# Altium schematic sheet Sheet2 (1).SchDoc
size A3; SheetNumber: 1; SheetTotal: 1
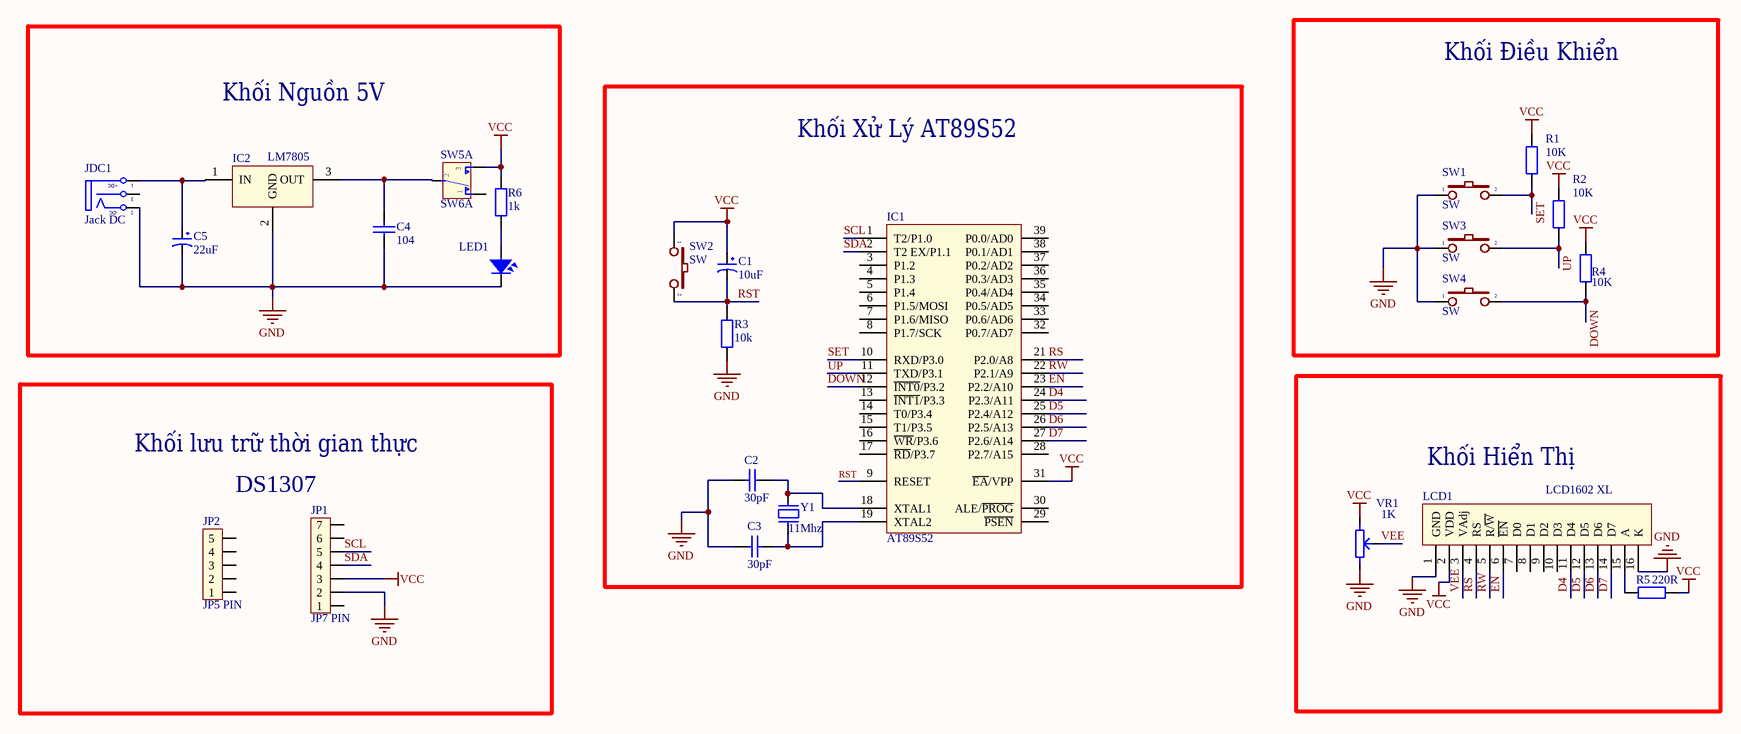
[diagram p0: Sheet2 (1).SchDoc]

## Parts
C1  10uF  [tu hoa 4mm]
C2  30pF  [tu gom]
C3  30pF  [tu gom]
C4  104  [tu gom]
C5  22uF  [tu hoa 5mm]
IC1  AT89S52  [DIP40/W0.6]
IC2  LM7805  [QTO-220]
JDC1  Jack DC  [DC-IN]
JP1  JP7 PIN  [JP7_1]
JP2  JP5 PIN  [JP5_1]
LCD1  LCD1602 XL  [LCD1602 with Jump]
LED1  LED  [LED-5-RED]  (value not drawn)
R1  10K  [tro vach 1/4w]
R2  10K  [tro vach 1/4w]
R3  10k  [tro vach 1/4w]
R4  10K  [tro vach 1/4w]
R5  220R  [tro vach 1/4w]
R6  1k  [R1/4W]
SW1  SW  [SW2]
SW2  SW  [SW2]
SW3  SW  [SW2]
SW4  SW  [SW2]
SW5  SW6A  [SW6]  (part A of 2)
VR1  1K  [Bien Tro Tam Giac Dung]
Y1  11Mhz  [Thach Anh 2 chan cam]

## Blocks framed on the sheet
Khối Điều Khiển: R1 R2 R4 SW1 SW3 SW4
Khối Nguồn 5V: C4 C5 IC2 JDC1 LED1 R6 SW5
Khối Xử Lý AT89S52: C1-C3 IC1 R3 SW2 Y1
Khối Hiển Thị: LCD1 R5 VR1

## Nets
GND: C2.2 C3.2 C4.2 C5.2 IC1.20(GND) IC2.2(GND) JDC1.2(TN) JP1.2 LCD1.1(GND) LCD1.16(K) LED1.2 R3.1 SW1.1 SW3.1 SW4.1 VR1.3
VCC: C1.1 IC1.31(~{EA}/VPP) IC1.40(VCC) JP1.3 LCD1.2(VDD) R1.1 R2.1 R4.1 R5.1 R6.2 SW2.1 SW5.3 VR1.1
D4: IC1.24(P2.3/A11) LCD1.11(D4)
D5: IC1.25(P2.4/A12) LCD1.12(D5)
D6: IC1.26(P2.5/A13) LCD1.13(D6)
D7: IC1.27(P2.6/A14) LCD1.14(D7)
DOWN: IC1.12(~{INT0}/P3.2) R4.2 SW4.2
EN: IC1.23(P2.2/A10) LCD1.6(~{EN})
RS: IC1.21(P2.0/A8) LCD1.4(RS)
RST: C1.2 IC1.9(RESET) R3.2 SW2.2
RW: IC1.22(P2.1/A9) LCD1.5(R/~{W})
SCL: IC1.1(T2/P1.0) JP1.5
SDA: IC1.2(T2_EX/P1.1) JP1.4
SET: IC1.10(RXD/P3.0) R1.2 SW1.2
UP: IC1.11(TXD/P3.1) R2.2 SW3.2
VEE: LCD1.3(VAdj) VR1.2
NetC2_1: C2.1 IC1.18(XTAL1) Y1.2
NetC3_1: C3.1 IC1.19(XTAL2) Y1.1
NetC4_1: C4.1 IC2.3(OUT) SW5.2
NetC5_1: C5.1 IC2.1(IN) JDC1.1(T)
NetLCD1_15: LCD1.15(A) R5.2
NetLED1_1: LED1.1 R6.1

Not connected (* = marked no-connect by the designer): IC1 3(P1.2) 4(P1.3) 5(P1.4) 6(P1.5/MOSI) 7(P1.6/MISO) 8(P1.7/SCK) 13(~{INT1}/P3.3) 14(T0/P3.4) 15(T1/P3.5) 16(~{WR}/P3.6) 17(~{RD}/P3.7) 28(P2.7/A15) 29(~{PSEN}) 30(ALE/~{PROG}) 32(P0.7/AD7) 33(P0.6/AD6) 34(P0.5/AD5) 35(P0.4/AD4) 36(P0.3/AD3) 37(P0.2/AD2) 38(P0.1/AD1) 39(P0.0/AD0); JDC1 3(S); JP1 1 6 7; JP2 1 2 3 4 5; LCD1 7(D0) 8(D1) 9(D2) 10(D3); SW5 1

## Notes on the sheet
- Khối lưu trữ thời gian thực
- DS1307
- (in symbol DCIN) +DC; -DC

## Library data of the parts
C1 = Tu Hoa 10uF 25V 4x7: Cắm; So_Chan: 2; Ten_Linh_Kien: Tụ Hóa 10uF 25V 4x7MM; Don_Vi: Con; Ma_Hang: MH001349; Chung_Loai: Cắm; Kieu_Chan: *
C2 C3 = Tu gom 30pF 50V: Cắm; Don_Vi: Con; So_Chan: 2; Ten_Linh_Kien: Tụ gốm 30P; Ma_Hang: MH004772; Chung_Loai: Cắm; Kieu_Chan: *
C4 = Tu gom 104 50V: Cắm; So_Chan: 2; Ten_Linh_Kien: Tụ gốm 104 100nF 50V; Don_Vi: Con; Ma_Hang: MH004761; Chung_Loai: Cắm; Kieu_Chan: *
C5 = Tu Hoa 22uF 50V 5x10: Cắm; Don_Vi: Con; So_Chan: 2; Ten_Linh_Kien: Tụ Hóa 22uF 50V; Ma_Hang: MH001359; Chung_Loai: Cắm; Kieu_Chan: *
IC1 = AT89S52: AT89S52, 8k Byte Flash Memory , 40 Pin; Value: AT89S52
IC2 = LM78xx: On ap +, from + 5 to + 24VDC; Value: LM7805
JDC1 = DCIN: Jac DC input; Value: Jac DC
JP1 = JP7: Value: JP7
JP2 = JP5: Value: JP5
LCD1 = LCD1602 XL: LCD 1602 Xanh Lá; Ten: Màn hình LCD 1602 Xanh Lá; Ma_Hang: 67HZ; NCC: NSHOP; CHIP: HD44780
LED1 = LED: LED Single colour Green and Red; Value: LED 3 ly Single Colour
R1 R2 R4 R5 = Tro Vach 1/4W 5% 220R: Cắm; Don_Vi: Con; So_Chan: 2; Ten_Linh_Kien: Trở Vạch 1/4w 5% 220R; Ma_Hang: MH007300; Chung_Loai: Cắm; Kieu_Chan: *
R3 = Tro Vach 1/4W 5% 10k: Căm; Chung_Loai: Cắm; Don_Vi: Con; So_Chan: 2; Ten_Linh_Kien: Trở Vạch 1/4w 5% 10K; Ma_Hang: MH007354; Kieu_Chan: *
R6 = R1/4W: Resistor 1/4W; Value: R1/4W - 1K
SW1-SW4 = SW2: Switch button 2 pin; Value: SW chip 2 pin
SW5 = SW6A: SW-DTDP - 6 Pin; Value: SW6
VR1 = Bien tro tam giac 1K Dung: Cắm; Ten_Linh_Kien: Biến Trở Tam Giác 102-1K RM065; Don_Vi: Con; Ma_Hang: MH003709; Ghi_Chu: *; Kieu_Chan: *; Chung_Loai: Cắm
Y1 = Thach Anh 2 chan Cam: Crystal For all Crystal 2pin.; Value: 4Mhz